# EAGLE schematic rev1 (EAGLE 7.2.0)
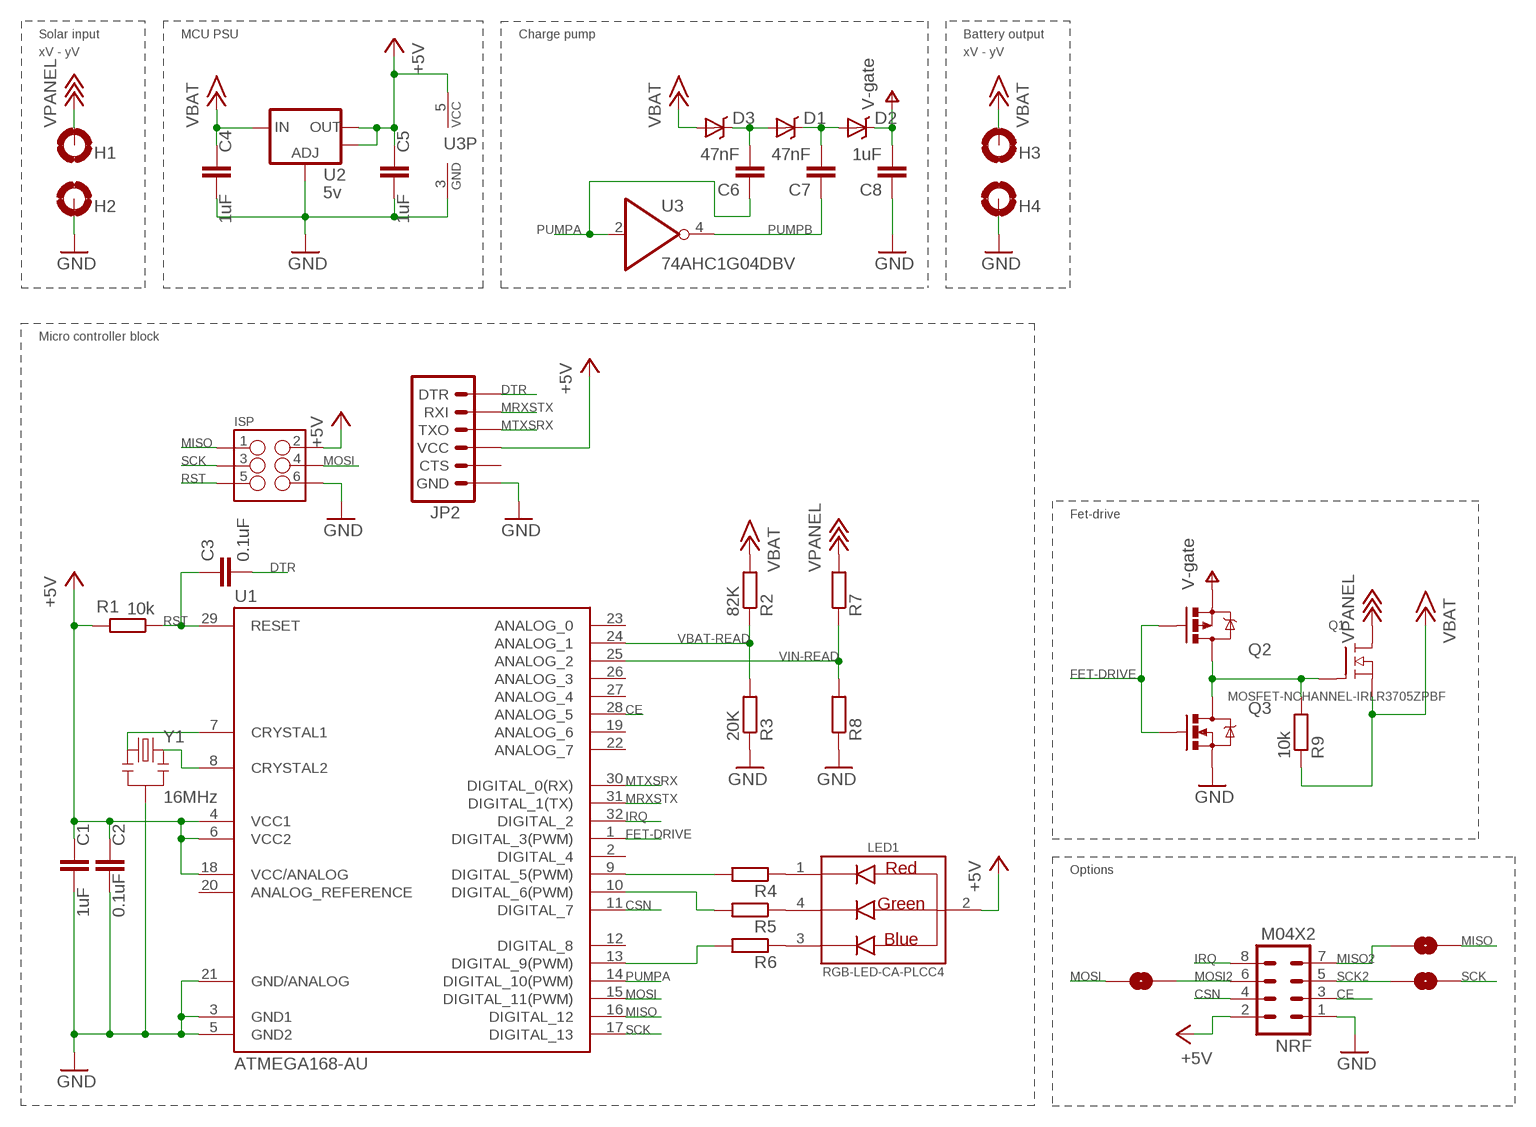
[diagram p0: schematic, sheet 1]

## Parts
C1  1uF  C-EUC0603K  [C0603K]
C2  0.1uF  C-EUC0603K  [C0603K]
C3  0.1uF  C-EUC0603K  [C0603K]
C4  1uF  C-EUC0603K  [C0603K]
C5  1uF  C-EUC0603K  [C0603K]
C6  47nF  C-EUC0603K  [C0603K]
C7  47nF  C-EUC0603K  [C0603K]
C8  1uF  C-EUC0603K  [C0603K]
D1  DIODE-SCHOTTKY  [SOD-523]
D2  DIODE-SCHOTTKY  [SOD-523]
D3  DIODE-SCHOTTKY  [SOD-523]
H1  MOUNT-PAD-ROUND3.0  [3,0-PAD]
H2  MOUNT-PAD-ROUND3.0  [3,0-PAD]
H3  MOUNT-PAD-ROUND3.0  [3,0-PAD]
H4  MOUNT-PAD-ROUND3.0  [3,0-PAD]
ISP  M03X22X3_SILK_SM  [2X3]
JP2  ARDUINO_SERIAL_PROGRAMLOCK  [1X06_LOCK]
LED1  RGB-LED-CA-PLCC4  [PLCC4]
NRF  M04X2  [2X4]
Q1  MOSFET-NCHANNEL-IRLR3705ZPBF  [DPAK]
Q2  MOSFET-PCHANNEL  [SOT23]
Q3  MOSFET-NCHANNELBSS138  [SOT23]
R1  10k  R-EU_R0603  [R0603]
R2  82K  R-EU_R0603  [R0603]
R3  20K  R-EU_R0603  [R0603]
R4  R-EU_R0603  [R0603]
R5  R-EU_R0603  [R0603]
R6  R-EU_R0603  [R0603]
R7  R-EU_R0603  [R0603]
R8  R-EU_R0603  [R0603]
R9  10k  R-EU_R0603  [R0603]
SJ2  SOLDERJUMPERNO  [SJ_2S-NO]
SJ5  SOLDERJUMPERNO  [SJ_2S-NO]
SJ6  SOLDERJUMPERNO  [SJ_2S-NO]
U1  ATMEGA168-AU  [TQFP32-08]
U2  5v  V_REG_LM1117SOT223  [SOT223]
U3  74AHC1G04DBV  [SOT23-5]
Y1  16MHz  RESONATOR16MHZ  [RESONATOR-SMD]

## Nets
+5V: C1.1 C2.1 C5.1 ISP.2 JP2.4(VCC) LED1.2(CA) NRF.2 R1.2 U1.4(VCC1) U1.6(VCC2) U1.18(VCC/ANALOG) U2.2(OUT) U2.4(OUT) U3.5(VCC)
+15V: C4.1 D3.A H3.B3,0(MOUNT) Q1.2(S) R2.2 R9.1 U2.3(IN) ; supply symbol labelled VBAT
+18V: H1.B3,0(MOUNT) Q1.TAB(D) R7.2 ; supply symbol labelled VPANEL
CE: NRF.3 U1.28(ANALOG_5)
CSN: NRF.4 U1.11(DIGITAL_7)
DTR: C3.2 JP2.1(DTR)
FET-DRIVE: Q2.1(G) Q3.1(G) U1.1(DIGITAL_3(PWM))
FET-PUMP: Q1.1(G) Q2.3(D) Q3.3(D) R9.2
GND: C1.2 C2.2 C4.2 C5.2 C8.1 H2.B3,0(MOUNT) H4.B3,0(MOUNT) ISP.6 JP2.6(GND) NRF.1 Q3.2(S) R3.1 R8.1 U1.3(GND1) U1.5(GND2) U1.21(GND/ANALOG) U2.1(ADJ) U3.3(GND) Y1.2
IRQ: NRF.8 U1.32(DIGITAL_2)
MISO: ISP.1 SJ6.2 U1.16(DIGITAL_12)
MISO2: NRF.7 SJ6.1
MOSI: ISP.4 SJ2.1 U1.15(DIGITAL_11(PWM))
MOSI2: NRF.6 SJ2.2
MRXSTX: JP2.2(RXI) U1.31(DIGITAL_1(TX))
MTXSRX: JP2.3(TXO) U1.30(DIGITAL_0(RX))
N$1: U1.8(CRYSTAL2) Y1.3
N$2: U1.7(CRYSTAL1) Y1.1
N$3: R4.2 U1.9(DIGITAL_5(PWM))
N$4: LED1.4(GC) R5.1
N$5: LED1.1(RC) R4.1
N$6: LED1.3(BC) R6.1
N$7: R5.2 U1.10(DIGITAL_6(PWM))
N$8: C7.2 D1.C D2.A
N$9: R6.2 U1.13(DIGITAL_9(PWM))
N$10: C6.2 D1.A D3.C
PUMPA: C6.1 U1.14(DIGITAL_10(PWM)) U3.2(I)
PUMPB: C7.1 U3.4(O)
RST: C3.1 ISP.5 R1.1 U1.29(RESET)
SCK: ISP.3 SJ5.2 U1.17(DIGITAL_13)
SCK2: NRF.5 SJ5.1
V+: C8.2 D2.C Q2.2(S) ; supply symbol labelled V-gate
VBAT-READ: R2.1 R3.2 U1.24(ANALOG_1)
VIN-READ: R7.1 R8.2 U1.25(ANALOG_2)
Unconnected: JP2.5(CTS) U1.2(DIGITAL_4) U1.12(DIGITAL_8) U1.19(ANALOG_6) U1.20(ANALOG_REFERENCE) U1.22(ANALOG_7) U1.23(ANALOG_0) U1.26(ANALOG_3) U1.27(ANALOG_4)

## Notes on the sheet
- Solar input | MCU PSU | Charge pump | Battery output
- xV - yV | xV - yV
- Micro controller block
- Fet-drive
- Options

## Library data of the parts
C1-C8 = resistor:C-EU: CAPACITOR, European symbol
D1-D3 = SparkFun-DiscreteSemi:DIODE-SCHOTTKY: Commonly MBRA140.
H1-H4 = holes:MOUNT-PAD-ROUND: MOUNTING PAD, round
ISP = SparkFun-Connectors:M03X2: 2x3 .1" header. Shrouded, with keying- CONN-10681 SMT- CONN-11415 Pogo pins- HW-11044
JP2 = SparkFun-Connectors:ARDUINO_SERIAL_PROGRAM: FTDI connector footprints
LED1 = Custom-parts:RGB-LED-CA-
NRF = SparkFun-Connectors:M04X2: .1" header, two rows of four.
Q1 = Custom-parts:MOSFET-NCHANNEL-
Q2 = SparkFun-DiscreteSemi:MOSFET-PCHANNEL: Generic PMOSFET
Q3 = SparkFun-DiscreteSemi:MOSFET-NCHANNEL: Common NMOSFET Parts MFG P/N Store ID Prod ID FDD8780 TRANS-09984 SI7820DN TRANS-11055 FDS6630A IC-08089 2N7002PW TRANS-11151 FQP30N06L COM-10213 TRANS-10060 BSS123LT1G TRANS-08345 BSS138 TRANS-00830 BS170 2N7000; PROD_ID: TRANS-00830
R1-R9 = resistor:R-EU_: RESISTOR, European symbol
SJ2 SJ5 SJ6 = SparkFun-Passives:SOLDERJUMPER: Solder Jumper Standard SMD solder jumper. Used to automate production. Two varients : Normally Open and Normally Closed are the same, but have different paste layers. NC will have a large amount of paste and should jumper during reflow.
U1 = Arduino-AVR:ATMEGA168
U2 = SparkFun-PowerIC:V_REG_LM1117: Voltage Regulator LM1117 Standard adjustable voltage regulator but in SMD form. Spark Fun Electronics SKU : COM-00595
U3 = 74xx-little-de:74*1G04: INVERTER Gate
Y1 = SparkFun-FreqCtrl:RESONATOR: Resonator Small SMD resonator. Used, eg, on the Arduino Pro/ Pro Mini boards. 8MHz- XTAL-08895 16MHz- XTAL-08900; PROD_ID: XTAL-08900